# EAGLE design eTapper1main41 (EAGLE 8.4.1)
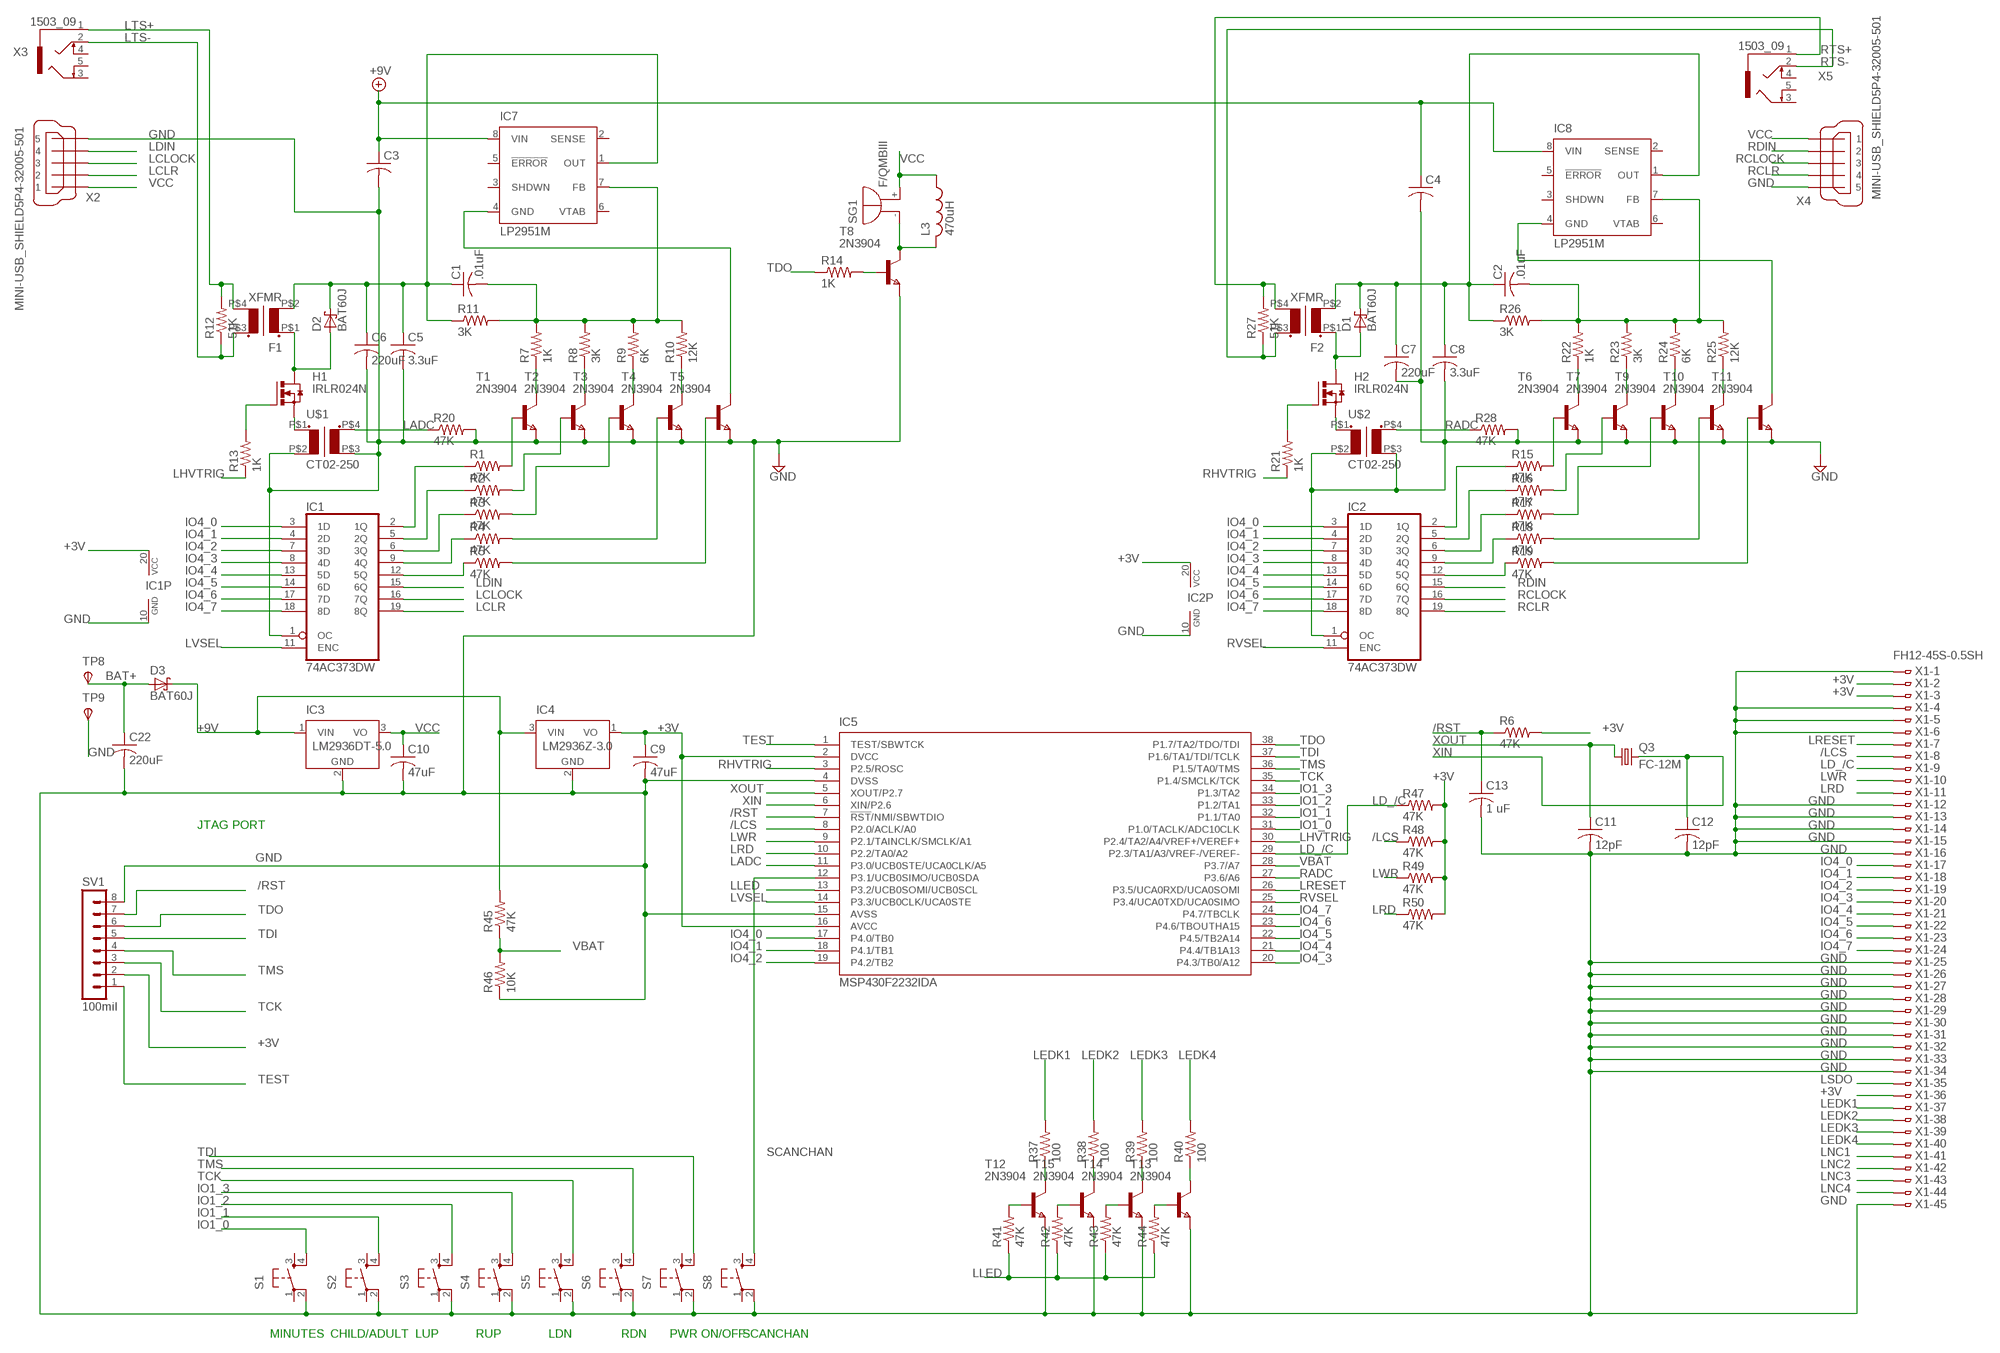
[diagram p0: schematic, sheet 1]

## Parts
C1  .01uF  C-USC0805  [C0805]
C2  .01uF  C-USC0805  [C0805]
C3  C-USC1206  [C1206]
C4  C-USC1206  [C1206]
C5  3.3uF  C-USC0805  [C0805]
C6  220uF  C-USC1206  [C1206]
C7  220uF  C-USC1206  [C1206]
C8  3.3uF  C-USC0805  [C0805]
C9  47uF  C-USC1206  [C1206]
C10  47uF  C-USC1206  [C1206]
C11  12pF  C-USC0805  [C0805]
C12  12pF  C-USC0805  [C0805]
C13  1 uF  C-USC0805  [C0805]
C22  220uF  C-USC1206  [C1206]
D1  BAT60J  [SOD323_ST]
D2  BAT60J  [SOD323_ST]
D3  BAT60J  [SOD323_ST]
F1  XFMR  [XFMR]
F2  XFMR  [XFMR]
H1  IRLR024N  [D-PAK_TO252AA]
H2  IRLR024N  [D-PAK_TO252AA]
IC1  74AC373DW  [SO20W]
IC2  74AC373DW  [SO20W]
IC3  LM2936DT-5.0  [TO252]
IC4  LM2936Z-3.0  [TO92]
IC5  MSP430F2232IDA  [TSSOP38_R-PDSO-G38-DA]
IC7  LP2951M  [SO08]
IC8  LP2951M  [SO08]
L3  470uH  L-USL2825P  [L2825P]
Q3  FC-12M  [FC-12M]
R1  47K  R-US_R0402  [R0402]
R2  47K  R-US_R0402  [R0402]
R3  47K  R-US_R0402  [R0402]
R4  47K  R-US_R0402  [R0402]
R5  47K  R-US_R0402  [R0402]
R6  47K  R-US_R0402  [R0402]
R7  1K  R-US_R0402  [R0402]
R8  3K  R-US_R0402  [R0402]
R9  6K  R-US_R0402  [R0402]
R10  12K  R-US_R0402  [R0402]
R11  3K  R-US_R0402  [R0402]
R12  51K  R-US_R0402  [R0402]
R13  1K  R-US_R0402  [R0402]
R14  1K  R-US_R0402  [R0402]
R15  47K  R-US_R0402  [R0402]
R16  47K  R-US_R0402  [R0402]
R17  47K  R-US_R0402  [R0402]
R18  47K  R-US_R0402  [R0402]
R19  47K  R-US_R0402  [R0402]
R20  47K  R-US_R0402  [R0402]
R21  1K  R-US_R0402  [R0402]
R22  1K  R-US_R0402  [R0402]
R23  3K  R-US_R0402  [R0402]
R24  6K  R-US_R0402  [R0402]
R25  12K  R-US_R0402  [R0402]
R26  3K  R-US_R0402  [R0402]
R27  51K  R-US_R0402  [R0402]
R28  47K  R-US_R0402  [R0402]
R37  100  R-US_R0402  [R0402]
R38  100  R-US_R0402  [R0402]
R39  100  R-US_R0402  [R0402]
R40  100  R-US_R0402  [R0402]
R41  47K  R-US_R0402  [R0402]
R42  47K  R-US_R0402  [R0402]
R43  47K  R-US_R0402  [R0402]
R44  47K  R-US_R0402  [R0402]
R45  47K  R-US_R0402  [R0402]
R46  10K  R-US_R0402  [R0402]
R47  47K  R-US_R0402  [R0402]
R48  47K  R-US_R0402  [R0402]
R49  47K  R-US_R0402  [R0402]
R50  47K  R-US_R0402  [R0402]
S1  10-XX  [B3F-10XX]
S2  10-XX  [B3F-10XX]
S3  10-XX  [B3F-10XX]
S4  10-XX  [B3F-10XX]
S5  10-XX  [B3F-10XX]
S6  10-XX  [B3F-10XX]
S7  10-XX  [B3F-10XX]
S8  10-XX  [B3F-10XX]
SG1  F/QMBIII  [F/QMBIII]
SV1  100mil  MA08-1  [MA08-1]
T1  2N3904  NPNSOT23  [SOT-23]
T2  2N3904  NPNSOT23  [SOT-23]
T3  2N3904  NPNSOT23  [SOT-23]
T4  2N3904  NPNSOT23  [SOT-23]
T5  2N3904  NPNSOT23  [SOT-23]
T6  2N3904  NPNSOT23  [SOT-23]
T7  2N3904  NPNSOT23  [SOT-23]
T8  2N3904  NPNSOT23  [SOT-23]
T9  2N3904  NPNSOT23  [SOT-23]
T10  2N3904  NPNSOT23  [SOT-23]
T11  2N3904  NPNSOT23  [SOT-23]
T12  2N3904  NPNSOT23  [SOT-23]
T13  2N3904  NPNSOT23  [SOT-23]
T14  2N3904  NPNSOT23  [SOT-23]
T15  2N3904  NPNSOT23  [SOT-23]
TP8  TPSPAD1-20  [P1-20]
TP9  TPSPAD1-20  [P1-20]
U$1  CT02-250  [CT02-250]
U$2  CT02-250  [CT02-250]
X1  FH12-45S-0.5SH  [FH12-45S-0.5SH]
X2  MINI-USB_SHIELD5P4-32005-501  [32005-501]
X3  1503_09  [1503_09]
X4  MINI-USB_SHIELD5P4-32005-501  [32005-501]
X5  1503_09  [1503_09]

## Nets
+3V [+3V]: C9.1 IC1.20(VCC) IC2.20(VCC) IC4.1(VO) IC5.2(DVCC) IC5.16(AVCC) R6.2 R47.2 R48.2 R49.2 R50.2 SV1.2 X1.2 X1.3 X1.36
+9V [+9V]: C3.1 C4.1 D3.C IC3.1(VIN) IC4.3(VIN) IC7.8(VIN) IC8.8(VIN) R45.2
/LCS: IC5.8(P2.0/ACLK/A0) R48.1 X1.8
/RST: C13.1 IC5.7(!RST!/NMI/SBWTDIO) R6.1 SV1.7
BAT+ [BAT+]: C22.1 D3.A TP8.TP(PP)
GND [GND]: C3.2 C4.2 C5.2 C6.2 C7.2 C8.2 C9.2 C10.2 C11.2 C12.2 C13.2 C22.2 IC1.1(OC) IC1.10(GND) IC2.1(OC) IC2.10(GND) IC3.2(GND) IC4.2(GND) IC5.4(DVSS) IC5.15(AVSS) R20.2 R28.2 R46.1 S1.2(P1) S2.2(P1) S3.2(P1) S4.2(P1) S5.2(P1) S6.2(P1) S7.2(P1) S8.2(P1) SV1.8 T1.2(E) T2.2(E) T3.2(E) T4.2(E) T5.2(E) T6.2(E) T7.2(E) T8.2(E) T9.2(E) T10.2(E) T11.2(E) T12.2(E) T13.2(E) T14.2(E) T15.2(E) TP9.TP(PP) U$1.P$2(P2) U$1.P$3(S2) U$2.P$2(P2) U$2.P$3(S2) X1.1 X1.4 X1.5 X1.6 X1.12 X1.13 X1.14 X1.15 X1.16 X1.25 X1.26 X1.27 X1.28 X1.29 X1.30 X1.31 X1.32 X1.33 X1.34 X1.45 X2.5 X4.5
IO1_0: IC5.31(P1.0/TACLK/ADC10CLK) S1.4(S1)
IO1_1: IC5.32(P1.1/TA0) S2.4(S1)
IO1_2: IC5.33(P1.2/TA1) S3.4(S1)
IO1_3: IC5.34(P1.3/TA2) S4.4(S1)
IO4_0: IC1.3(1D) IC2.3(1D) IC5.17(P4.0/TB0) X1.17
IO4_1: IC1.4(2D) IC2.4(2D) IC5.18(P4.1/TB1) X1.18
IO4_2: IC1.7(3D) IC2.7(3D) IC5.19(P4.2/TB2) X1.19
IO4_3: IC1.8(4D) IC2.8(4D) IC5.20(P4.3/TB0/A12) X1.20
IO4_4: IC1.13(5D) IC2.13(5D) IC5.21(P4.4/TB1A13) X1.21
IO4_5: IC1.14(6D) IC2.14(6D) IC5.22(P4.5/TB2A14) X1.22
IO4_6: IC1.17(7D) IC2.17(7D) IC5.23(P4.6/TBOUTHA15) X1.23
IO4_7: IC1.18(8D) IC2.18(8D) IC5.24(P4.7/TBCLK) X1.24
LADC: IC5.11(P3.0/UCB0STE/UCA0CLK/A5) R20.1 U$1.P$4(S1)
LCLOCK: IC1.16(7Q) X2.3
LCLR: IC1.19(8Q) X2.2
LD_/C: IC5.29(P2.3/TA1/A3/VREF-/VEREF-) R47.1 X1.9
LDIN: IC1.15(6Q) X2.4
LEDK1: R37.2 X1.37
LEDK2: R38.2 X1.38
LEDK3: R39.2 X1.39
LEDK4: R40.2 X1.40
LHVTRIG: IC5.30(P2.4/TA2/A4/VREF+/VEREF+) R13.1
LLED: IC5.13(P3.2/UCB0SOMI/UCB0SCL) R41.1 R42.1 R43.1 R44.1
LNC1: X1.41
LNC2: X1.42
LNC3: X1.43
LNC4: X1.44
LRD: IC5.10(P2.2/TA0/A2) R50.1 X1.11
LRESET: IC5.26(P3.5/UCA0RXD/UCA0SOMI) X1.7
LSDO: X1.35
LTS+: F1.P$4(S2) R12.2 X3.1
LTS-: F1.P$3(S1) R12.1 X3.2
LVSEL: IC1.11(ENC) IC5.14(P3.3/UCB0CLK/UCA0STE)
LWR: IC5.9(P2.1/TAINCLK/SMCLK/A1) R49.1 X1.10
N$1: IC1.2(1Q) R1.1
N$2: IC1.5(2Q) R2.1
N$3: IC1.6(3Q) R3.1
N$4: IC1.9(4Q) R4.1
N$5: IC1.12(5Q) R5.1
N$6: L3.2 SG1.-(+) T8.1(C)
N$7: R4.2 T4.3(B)
N$8: R5.2 T5.3(B)
N$9: D2.A F1.P$1(P1) H1.4(D)
N$10: R7.1 T1.1(C)
N$11: R8.1 T2.1(C)
N$12: R9.1 T3.1(C)
N$13: R1.2 T1.3(B)
N$14: R2.2 T2.3(B)
N$15: R3.2 T3.3(B)
N$16: R10.1 T4.1(C)
N$17: C1.2 IC7.7(FB) R7.2 R8.2 R9.2 R10.2 R11.2
N$18: C1.1 C5.1 C6.1 D2.C F1.P$2(P2) IC7.1(OUT) R11.1
N$19: D1.A F2.P$1(P1) H2.4(D)
N$20: IC2.2(1Q) R15.1
N$21: H1.1(G) R13.2
N$22: R14.2 T8.3(B)
N$23 [GND]: H1.3(S) U$1.P$1(P1)
N$24: IC2.5(2Q) R16.1
N$25: IC2.6(3Q) R17.1
N$26: IC2.9(4Q) R18.1
N$27: IC2.12(5Q) R19.1
N$28: R44.2 T13.3(B)
N$29: R15.2 T6.3(B)
N$30: R16.2 T7.3(B)
N$31: R17.2 T9.3(B)
N$32: R18.2 T10.3(B)
N$33: R19.2 T11.3(B)
N$35: R22.1 T6.1(C)
N$36: R23.1 T7.1(C)
N$37: R24.1 T9.1(C)
N$38: R25.1 T10.1(C)
N$39: C2.2 IC8.7(FB) R22.2 R23.2 R24.2 R25.2 R26.2
N$40: C2.1 C7.1 C8.1 D1.C F2.P$2(P2) IC8.1(OUT) R26.1
N$41: R37.1 T12.1(C)
N$42: H2.1(G) R21.2
N$43: R38.1 T15.1(C)
N$44: R39.1 T14.1(C)
N$45: IC7.4(GND) T5.1(C)
N$46: R40.1 T13.1(C)
N$47: IC8.4(GND) T11.1(C)
N$48: R43.2 T14.3(B)
N$49: R41.2 T12.3(B)
N$50: R42.2 T15.3(B)
N$51 [GND]: H2.3(S) U$2.P$1(P1)
RADC: IC5.27(P3.6/A6) R28.1 U$2.P$4(S1)
RCLOCK: IC2.16(7Q) X4.3
RCLR: IC2.19(8Q) X4.4
RDIN: IC2.15(6Q) X4.2
RHVTRIG: IC5.3(P2.5/ROSC) R21.1
RTS+: F2.P$4(S2) R27.2 X5.1
RTS-: F2.P$3(S1) R27.1 X5.2
RVSEL: IC2.11(ENC) IC5.25(P3.4/UCA0TXD/UCA0SIMO)
SCANCHAN: IC5.12(P3.1/UCB0SIMO/UCB0SDA) S8.4(S1)
TCK: IC5.35(P1.4/SMCLK/TCK) S5.4(S1) SV1.3
TDI: IC5.37(P1.6/TA1/TDI/TCLK) S7.4(S1) SV1.5
TDO: IC5.38(P1.7/TA2/TDO/TDI) R14.1 SV1.6
TEST: IC5.1(TEST/SBWTCK) SV1.1
TMS: IC5.36(P1.5/TA0/TMS) S6.4(S1) SV1.4
VBAT: IC5.28(P3.7/A7) R45.1 R46.2
VCC [VCC]: C10.1 IC3.3(VO) L3.1 SG1.+(-) X2.1 X4.1
XIN: C12.1 IC5.6(XIN/P2.6) Q3.2
XOUT: C11.1 IC5.5(XOUT/P2.7) Q3.1
Unconnected: IC7.2(SENSE) IC7.3(SHDWN) IC7.5(!ERROR) IC7.6(VTAB) IC8.2(SENSE) IC8.3(SHDWN) IC8.5(!ERROR) IC8.6(VTAB) S1.1(P) S1.3(S) S2.1(P) S2.3(S) S3.1(P) S3.3(S) S4.1(P) S4.3(S) S5.1(P) S5.3(S) S6.1(P) S6.3(S) S7.1(P) S7.3(S) S8.1(P) S8.3(S) X2.M1(S1) X2.M2(S2) X2.M3(S3) X2.M4(S4) X3.3 X3.4 X3.5 X4.M1(S1) X4.M2(S2) X4.M3(S3) X4.M4(S4) X5.3 X5.4 X5.5

## Notes on the sheet
- JTAG PORT
- MINUTES | CHILD/ADULT | LUP | RUP | LDN | RDN | PWR ON/OFF | SCANCHAN

## Library data of the parts
C1-C13 C22 = rcl:C-US: CAPACITOR, American symbol
D1-D3 = diode:BAT60J: Schottky barrier diode Source: www.st.com, BAT60J.pdf
F1 F2 = XFMR1:XFMR: Transformer 1"X1" 0.4"X0.4" hole separation for e_tapper
H1 H2 = IRLR024N:IRLR024N: IRLR024N HEXFET Power Mosfet N channel Infeneon Technology TO-251AA IPAK
IC1 IC2 = 74xx-eu:74*373: Octal D type transparent LATCH, edge triggered
IC3 = national-semiconductor:LM2936?*: Ultra-Low Quiescent Current LDO Voltage Regulator Source: Data sheet <http://www.national.com/ds/LM/LM2936.pdf>; MF: NATIONAL SEMICONDUCTOR; MPN: LM2936DT-5.0/NOPB; OC_FARNELL: 1286864; OC_NEWARK: 41K4501
IC4 = national-semiconductor:LM2936?*: Ultra-Low Quiescent Current LDO Voltage Regulator Source: Data sheet <http://www.national.com/ds/LM/LM2936.pdf>; MF: NATIONAL SEMICONDUCTOR; MPN: LM2936Z-3.0/NOPB; OC_FARNELL: 1312709; OC_NEWARK: 41K4531
IC5 = texas:MSP430F22*2IDA: MIXED SIGNAL MICROCONTROLLER Source: http://focus.ti.com/lit/ds/symlink/msp430f2274.pdf; MPN: MSP430F2232IDA; OC_FARNELL: 1610178; OC_NEWARK: 28M6312
IC7 IC8 = national-semiconductor:LP2951: Adjustable Micropower Voltage Regulator Source: http://www.national.com/ds/LP/LP2950.pdf; MF: FAIRCHILD SEMICONDUCTOR; MPN: LP2951CM; OC_FARNELL: 9488561; OC_NEWARK: 78K6014
L3 = rcl:L-US: INDUCTOR, American symbol
Q3 = crystal:FC-12M: kHz RANGE CRYSTAL UNIT LOW PROFILE SMD Source: Epson Toyocom FC-12M.pdf
R1-R28 R37-R50 = resistor:R-US_: RESISTOR, American symbol
S1-S8 = switch-omron:10-XX: OMRON SWITCH; MPN: B3F-1000; OC_FARNELL: 176432; OC_NEWARK: 36M3542
SG1 = buzzer:F/QMBIII: BUZZER Source: Buerklin; OC_FARNELL: unknown; OC_NEWARK: unknown
SV1 = con-lstb:MA08-1: PIN HEADER; OC_FARNELL: unknown; OC_NEWARK: unknown
T1-T15 = zetex:NPNSOT23: NPN TRANSISTOR; MPN: DSS20201L-7; OC_FARNELL: 1710688; OC_NEWARK: 25R4555
TP8 TP9 = testpad:TPS: TEST PIN
U$1 U$2 = CT02-250:CT02-250: Current Transformer ICE Components 1:250 turns ratio
X1 = con-hirose:FH12-45S-0.5S: 0.5mm Pitch Connectors For FPC/FFC Source: Data sheet <http://www.hirose.co.jp/cataloge_hp/e58605370.pdf>; OC_FARNELL: unknown; OC_NEWARK: unknown
X2 X4 = con-cypressindustries:MINI-USB_SHIELD5P4-: MINI USB-B R/A W/O POST 5 pol. Source: www.cypressindustries.com; OC_FARNELL: unknown; OC_NEWARK: unknown
X3 X5 = con-lumberg:1503_09: Jack connectors according to JISC 6560, 3.5 mm Klinkeneinbaukupplung nach JISC 6560, 3,5 mm, 3-polig/ stereo, abgewinkelte Ausführung, mit 2 Öffnern und Lötaugen, für Leiterplatten Rückseitenmontage Source: http://www.lumberg.com/Produkte/PDFs/1503_09.pdf; OC_FARNELL: 1243244; OC_NEWARK: unknown

## Module LP2951
Ports: 

### Library data of the parts

## Net classes
1 GND: width 0.305 mm, clearance 0.152 mm
2 BAT+: width 0.305 mm, clearance 0.152 mm
3 +9V: width 0.305 mm, clearance 0.152 mm
4 +3V: width 0.305 mm, clearance 0.152 mm
5 VCC: width 0.305 mm, clearance 0.152 mm

## Board
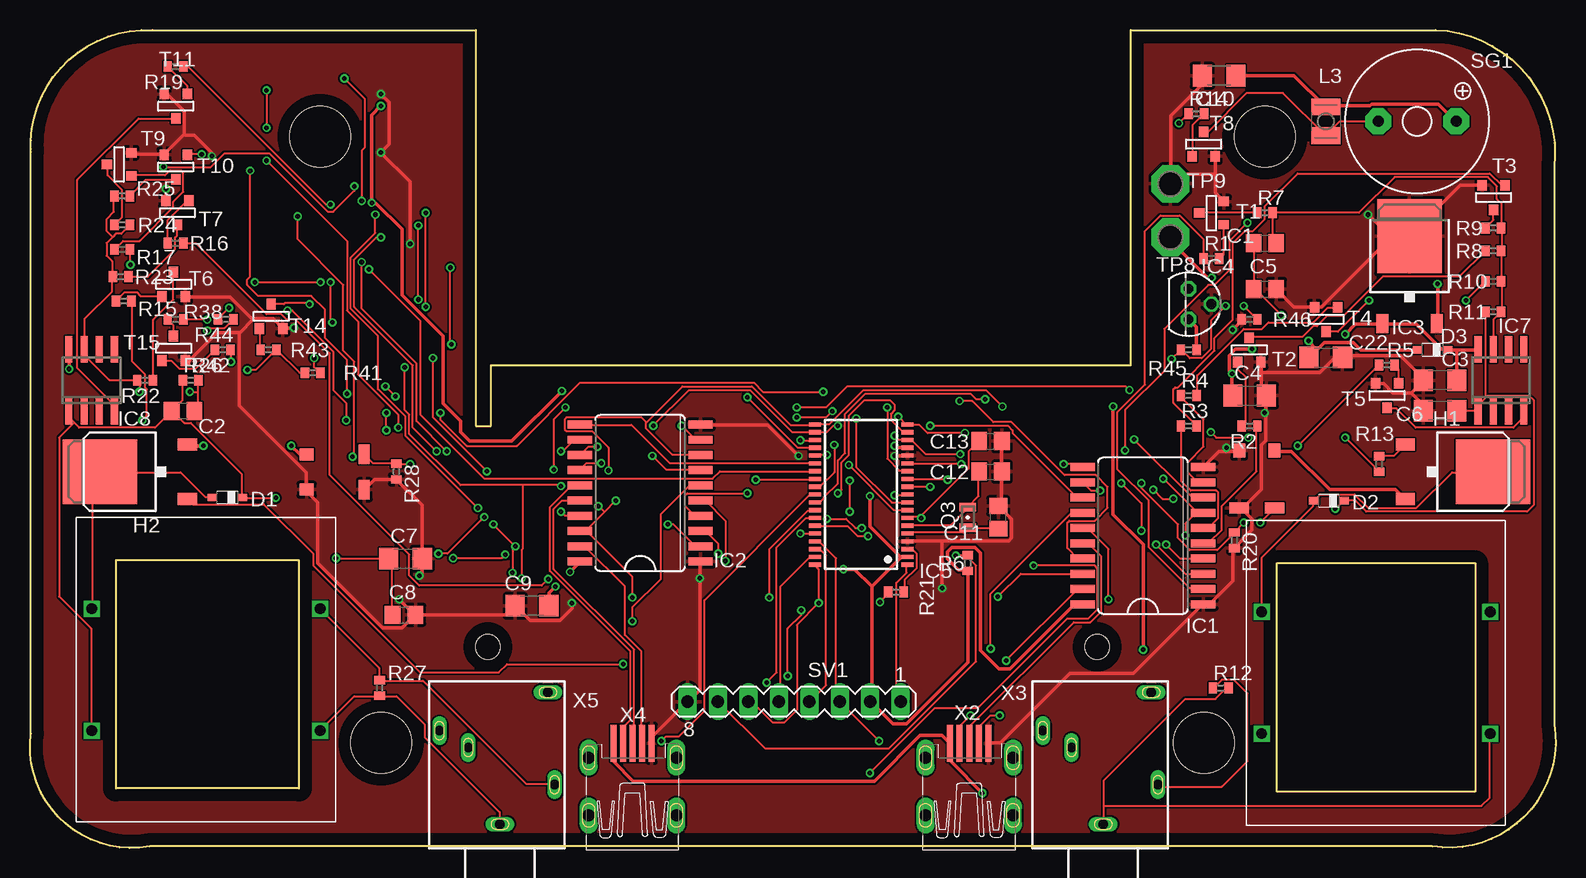
[diagram p1: board, top side]
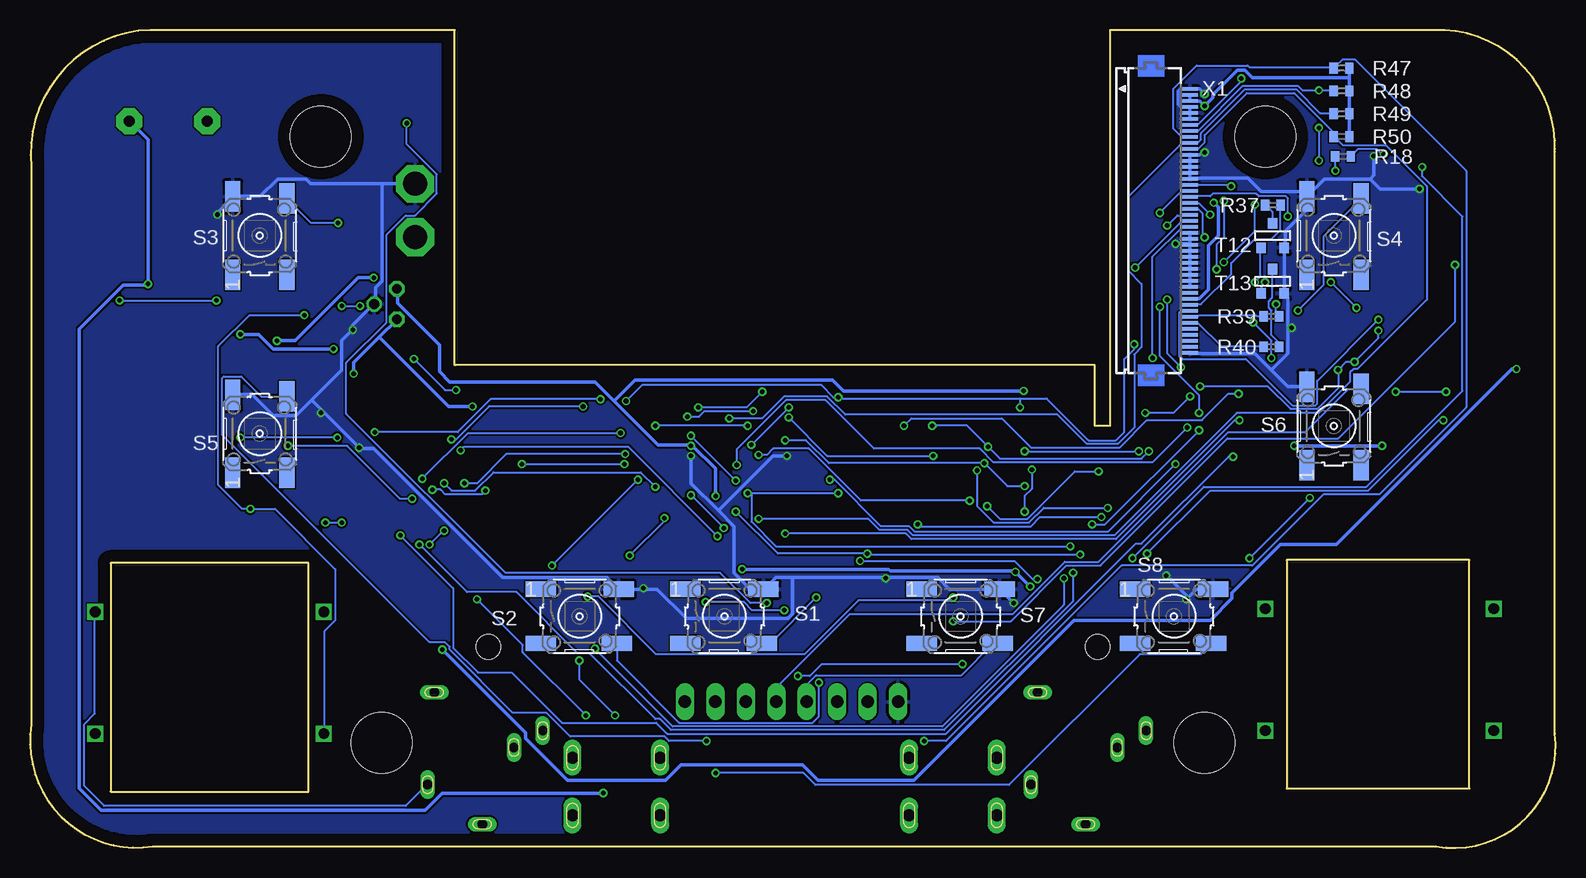
[diagram p2: board, bottom side, seen from below]

Size 127.17 x 68.21 mm. Coordinates in mm from the lower left corner, seen from the top.
Outline: 0.06,58.04 0.06,58.3 0.06,9.53
Outline: 0.06,58.04 0.06,9.53
Outline: 0.06,58.04 arc-96 10.22,68.2 37.15,68.2 37.15,35.18 38.42,35.18 38.42,40.26 91.76,40.26 91.76,68.2 117.16,68.2 arc-94 127.06,56.77 127.06,10.29 arc-108 116.9,0.13 9.97,0.13 arc-107 0.06,9.53
Outline: 103.95,23.75 120.46,23.75 120.46,4.7 103.95,4.7 103.95,23.75
Outline: 7.18,24.01 22.42,24.01 22.42,4.96 7.18,4.96 7.18,24.01
Copper layers (1*16): Top 0.035mm / dielectric 30mil / Bottom 0.035mm
Design rules "default *": minimum track width 6mil, minimum drill 15mil, track to track 6mil, track to pad 6mil, pad to pad 6mil, via to via 6mil, smd to smd 6mil, copper to edge 40mil, drill to drill 6mil, minimum pad ring 6mil, minimum via ring 6mil, stop-mask expansion 4mil, vias tented up to drill 0mil, thermal gap 10mil
Holes 5.08 mm at 24.19,59.31 102.93,59.31 29.27,8.77 97.85,8.77
Holes 2.03 mm at 38.16,16.77 88.96,16.77

### Footprints (pad centres in the part's own frame; a part is rotated, then mirrored left to right if it is on the bottom)
C0805 = smd 1.3 x 1.5: 1 -0.95,0; 2 0.95,0
C1206 = smd 1.6 x 1.8: 1 -1.4,0; 2 1.4,0
SOD323_ST = smd 0.8 x 0.6: A 1.25,0; C -1.25,0
XFMR = drill 0.889 square: P$1 -10.16,5.08; P$2 -10.16,-5.08; P$3 8.89,5.08; P$4 8.89,-5.08
D-PAK_TO252AA = smd 1 x 1.6: 1 -2.28,-4.8; 3 2.28,-4.8 | smd 5.4 x 6.2: 4 0,2.5
SO20W = smd 0.66 x 2.032: 1 -5.715,-5.029; 2 -4.445,-5.029; 3 -3.175,-5.029; 4 -1.905,-5.029; 5 -0.635,-5.029; 6 0.635,-5.029; 7 1.905,-5.029; 8 3.175,-5.029; 9 4.445,-5.029; 10 5.715,-5.029; 11 5.715,5.029; 12 4.445,5.029; 13 3.175,5.029; 14 1.905,5.029; 15 0.635,5.029; 16 -0.635,5.029; 17 -1.905,5.029; 18 -3.175,5.029; 19 -4.445,5.029; 20 -5.715,5.029
TO252 = smd 1 x 1.6: 1 -2.28,-4.8; 3 2.28,-4.8 | smd 5.4 x 6.2: 2 0,2.5
TO92 = drill 0.813 pad 1.27 octagon: 1 -1.27,0; 2 0,1.905; 3 1.27,0
TSSOP38_R-PDSO-G38-DA = smd 0.35 x 1: 1 -5.85,-3.85; 2 -5.2,-3.85; 3 -4.55,-3.85; 4 -3.9,-3.85; 5 -3.25,-3.85; 6 -2.6,-3.85; 7 -1.95,-3.85; 8 -1.3,-3.85; 9 -0.65,-3.85; 10 0,-3.85; 11 0.65,-3.85; 12 1.3,-3.85; 13 1.95,-3.85; 14 2.6,-3.85; 15 3.25,-3.85; 16 3.9,-3.85; 17 4.55,-3.85; 18 5.2,-3.85; 19 5.85,-3.85; 20 5.85,3.85; 21 5.2,3.85; 22 4.55,3.85; 23 3.9,3.85; 24 3.25,3.85; 25 2.6,3.85; 26 1.95,3.85; 27 1.3,3.85; 28 0.65,3.85; 29 0,3.85; 30 -0.65,3.85; 31 -1.3,3.85; 32 -1.95,3.85; 33 -2.6,3.85; 34 -3.25,3.85; 35 -3.9,3.85; 36 -4.55,3.85; 37 -5.2,3.85; 38 -5.85,3.85
SO08 = smd 0.6 x 2.2: 1 -1.905,-2.6; 2 -0.635,-2.6; 3 0.635,-2.6; 4 1.905,-2.6; 5 1.905,2.6; 6 0.635,2.6; 7 -0.635,2.6; 8 -1.905,2.6
L2825P = smd 1.4 x 2.4: 1 -1.2,0; 2 1.2,0
FC-12M = smd 0.7 x 1.4: 1 -0.85,0; 2 0.85,0
R0402 = smd 0.7 x 0.9: 1 -0.65,0; 2 0.65,0
B3F-10XX = smd 2.54 x 1.27: 1 -3.251,2.261; 2 3.251,2.261; 3 -3.251,-2.261; 4 3.099,-2.261
F/QMBIII = drill 0.914 pad 2.159 octagon: + 3.251,0; - -3.251,0
MA08-1 = drill 1.016 long: 1 -8.89,0; 2 -6.35,0; 3 -3.81,0; 4 -1.27,0; 5 1.27,0; 6 3.81,0; 7 6.35,0; 8 8.89,0
SOT-23 = smd 0.787 x 0.889: 1 0.025,-1.016; 2 -0.94,1.016; 3 0.991,1.016
P1-20 = drill 2.007 pad 3.15 octagon: TP 0,0
CT02-250 = smd 1 x 1.2: P$1 -1.45,-2.4; P$2 1.5,-2.4 | smd 1.6 x 0.9: P$3 1.5,2.4; P$4 -1.45,2.4
FH12-45S-0.5SH = smd 0.3 x 1.3: 1 -13,3.25; 2 -12.5,3.25; 3 -12,3.25; 4 -11.5,3.25; 5 -11,3.25; 6 -10.5,3.25; 7 -10,3.25; 8 -9.5,3.25; 9 -9,3.25; 10 -8.5,3.25; 11 -8,3.25; 12 -7.5,3.25; 13 -7,3.25; 14 -6.5,3.25; 15 -6,3.25; 16 -5.5,3.25; 17 -5,3.25; 18 -4.5,3.25; 19 -4,3.25; 20 -3.5,3.25; 21 -3,3.25; 22 -2.5,3.25; 23 -2,3.25; 24 -1.5,3.25; 25 -1,3.25; 26 -0.5,3.25; 27 0,3.25; 28 0.5,3.25; 29 1,3.25; 30 1.5,3.25; 31 2,3.25; 32 2.5,3.25; 33 3,3.25; 34 3.5,3.25; 35 4,3.25; 36 4.5,3.25; 37 5,3.25; 38 5.5,3.25; 39 6,3.25; 40 6.5,3.25; 41 7,3.25; 42 7.5,3.25; 43 8,3.25; 44 8.5,3.25; 45 9,3.25
32005-501 = smd 3.1 x 0.5: 1 3,1.6; 2 3,0.8; 3 3,0; 4 3,-0.8; 5 3,-1.6 | drill 1 pad 1.422 long: M1 -3,3.65; M2 -3,-3.65; M3 1.8,3.65; M4 1.8,-3.65
1503_09 = drill 0.8 pad 1.2 long: 1 0,-2.1; 2 -4.55,-5.4; 3 5.05,-9.9; 4 -4,-13.1; 5 2.65,-8.5

### Placement (x,y rotation side)
C1  102.93,50.42 0 top
C2  12.76,36.45 0 top
C3  117.54,38.99 180 top
C4  101.66,37.72 0 top
C5  102.93,46.61 0 top
C6  117.54,36.45 180 top
C7  31.31,24.14 0 top
C8  31.18,19.44 0 top
C9  41.85,20.2 180 top
C10  99.12,64.39 180 top
C11  80.71,27.56 90 top
C12  80.07,31.37 0 top
C13  80.07,33.91 0 top
C22  108.01,40.9 0 top
D1  16.45,29.22 180 top
D2  108.27,28.96 180 top
D3  116.9,41.53 180 top
F1  112.84,14.61 0 top
F2  15.3,14.86 0 top
H1  119.44,31.37 270 top
H2  8.32,31.37 90 top
IC1  92.77,26.04 90 top
IC2  50.86,29.6 90 top
IC3  115,48.52 0 top
IC4  96.58,45.34 270 top
IC5  69.28,29.47 90 top
IC7  122.62,38.99 0 top
IC8  5.14,38.99 0 top
L3  108.01,60.58 270 top
Q3  78.17,27.56 90 top
R1  98.49,49.15 0 top
R2  101.66,35.18 180 top
R3  96.58,35.18 0 top
R4  96.58,37.72 0 top
R5  113.09,40.26 0 top
R6  78.17,23.75 270 top
R7  102.93,52.96 0 top
R8  121.98,49.79 0 top
R9  121.98,51.69 0 top
R10  121.98,47.25 0 top
R11  121.98,44.71 0 top
R12  99.25,13.34 0 top
R13  112.46,32.01 90 top
R14  97.22,61.22 0 top
R15  7.81,45.6 180 top
R16  12.13,50.42 180 top
R17  7.68,49.92 180 top
R18  17.72,57.66 0 bottom
R19  12.13,65.16 180 top
R20  100.39,25.66 270 top
R21  72.2,21.34 180 top
R22  9.59,38.99 180 top
R23  7.56,47.63 180 top
R24  7.68,51.95 0 top
R25  7.68,54.36 180 top
R26  13.4,38.99 0 top
R27  29.15,13.34 270 top
R28  30.54,31.37 270 top
R37  23.56,53.6 0 bottom
R38  12.13,44.07 0 top
R39  23.69,44.33 180 bottom
R40  23.69,41.79 180 bottom
R41  23.56,39.63 0 top
R42  16.07,41.53 180 top
R43  19.88,41.53 180 top
R44  16.32,44.07 180 top
R45  96.58,41.53 0 top
R46  101.66,44.07 0 top
R47  17.84,65.03 0 bottom
R48  17.84,63.12 0 bottom
R49  17.84,61.22 0 bottom
R50  17.84,59.31 0 bottom
S1  69.28,19.31 0 bottom
S2  81.34,19.31 0 bottom
S3  108.01,51.06 90 bottom
S4  18.48,51.06 90 bottom
S5  108.01,34.55 90 bottom
S6  18.48,35.18 90 bottom
S7  49.59,19.31 0 bottom
S8  31.81,19.31 0 bottom
SG1  115.63,60.58 0 top
SV1  63.69,12.2 180 top
T1  98.49,52.96 270 top
T2  101.66,41.53 180 top
T3  121.98,54.23 0 top
T4  108.01,44.07 0 top
T5  113.09,37.72 0 top
T6  12,47 180 top
T7  12.26,52.96 0 top
T8  97.85,58.68 180 top
T9  7.43,57.03 270 top
T10  12.13,56.77 0 top
T11  12.13,61.85 0 top
T12  23.56,51.06 180 bottom
T13  23.56,47.25 180 bottom
T14  20.13,44.33 180 top
T15  12,41.66 180 top
TP8  95.06,50.93 0 top
TP9  95.06,55.38 0 top
U$1  102.3,30.74 180 top
U$2  25.46,31.37 270 top
X1  33.72,50.3 270 bottom
X2  78.3,5.72 90 top
X3  89.47,-0.12 180 top
X4  50.23,5.72 90 top
X5  39.18,-0.12 180 top

### Tracks (layer width: path | path; a pad name or v marks a point on that pad's centre or on a via)
+3V  (via drill 0.38)
  Top 0.305: v29.25,61.88 28.49,61.12 v28.49,53.8 28.56,53.73 28.87,53.73 31,51.59 31,46.11 34.43,42.68 34.43,37.04 35.88,35.59 35.88,34.68 36.64,33.91 40.14,33.91 v44.34,38.11 | v43.8,21.8 43.27,21.27 43.27,20.2 C9.1 | v45.02,23.02 45.86,23.86 IC2.20 | 72.61,24.24 73.06,24.24 IC5.2 | 70.17,21.8 72.61,24.24 | 70.17,21.8 70.17,12.27 SV1.2 70.09,12.2 71.92,10.37 73.06,10.37 78.17,15.47 R6.2 78.09,23.17 77.41,23.17 76.49,24.08 76.49,24.69 76.87,25.08 78.78,25.08 79.24,24.62 79.24,16.46 80.76,14.94 81.67,14.94 87.01,20.27 87.69,20.27 IC1.20 | v72.07,33.53 72.22,33.38 73.06,33.38 IC5.16 | v70.02,29.34 70.02,26.83 72.61,24.24 | v67.81,23.25 68.72,23.25 70.17,21.8
  Bottom 0.305: R50.2 17.21,59.37 17.21,61.19 R49.2 17.21,61.35 17.21,63.1 R48.2 17.21,63.25 17.21,64.24 | 17.21,64.24 17.21,65 R47.2 | v28.49,53.8 28.11,53.42 28.11,51.06 28.94,50.22 28.94,46.56 29.71,45.8 X1.36 | X1.2 30.47,62.41 X1.3 30.47,62.26 29.63,62.26 v29.25,61.88 28.56,62.57 28.56,62.79 26.5,64.85 25.9,64.85 25.29,64.24 17.21,64.24 | v43.8,21.8 v45.02,23.02 45.1,23.09 55.46,23.09 55.61,23.25 v67.81,23.25 | v70.02,29.34 70.02,31.63 71.92,33.53 v72.07,33.53 72.15,33.61 74.82,33.61 78.47,37.27 | 78.47,37.27 80.07,38.87 92.19,38.87 93.03,39.71 93.03,41.92 96.53,45.42 96.53,46.56 IC4.1 | v44.34,38.11 59.35,38.11 60.26,39.02 76.72,39.02 78.47,37.27
+9V  (via drill 0.38)
  Top 0.305: 118.94,41.53 120.69,41.53 IC7.8 | 118.94,41.53 D3.C 118.02,41.61 117.64,41.61 115.58,43.67 112.76,43.67 IC3.1 112.61,43.67 110.48,43.67 v109.64,42.83 | 118.94,41.53 118.94,39.02 C3.1 | IC4.3 97.22,43.44 97.22,41.53 R45.2 | C4.1 100.19,37.72 v100.19,39.55 99.96,39.78 99.96,41.08 100.5,41.61 v101.87,41.61 | v3.26,39.93 3.26,41.53 IC8.8 | v92.8,16.54 92.8,25.3 90.28,27.82 v90.28,36.81
  Bottom 0.305: v100.19,39.55 100.19,40.47 98.06,42.6 | IC4.3 98.06,42.6 | v3.26,39.93 3.64,39.93 18.28,25.3 22.92,25.3 26.96,21.27 26.96,20.81 28.79,18.98 40.14,18.98 53.48,5.64 61.48,5.64 62.78,6.94 72.91,6.94 74.21,5.64 82.36,5.64 85.86,9.15 85.86,9.61 v92.8,16.54 | v90.28,36.81 92.27,36.81 98.06,42.6 | v109.64,42.83 108.12,42.83 106.9,41.61 v101.87,41.61
/LCS  (via drill 0.38)
  Top 0.152: v68.26,31.93 72,28.2 73.06,28.2 IC5.8 | v30.7,35.06 30.7,36.12 27.34,39.48 27.34,43.9 26.43,44.81 26.43,50.6 v19.72,57.31 | v19.72,63.18 v19.72,60.05
  Bottom 0.152: R48.1 18.5,63.18 v19.72,63.18 21.09,63.18 21.48,63.56 26.05,63.56 29.78,59.82 30.47,59.82 X1.8 | v68.26,31.93 68.26,33.23 64.15,37.34 60.87,37.34 56.83,33.3 47.99,33.3 46.85,32.16 33.59,32.16 v30.7,35.06 | v19.72,60.05 v19.72,57.31
/RST  (via drill 0.38)
  Top 0.152: 74.24,27.63 78.24,31.63 78.24,33.08 79.08,33.91 C13.1 | 74.24,27.63 74.21,27.59 73.14,27.59 IC5.7 | 78.17,24.39 78.17,24.24 78.85,23.55 78.85,15.55 71.62,8.31 61.25,8.31 57.37,12.2 SV1.7 | v74.28,27.51 74.28,27.59 74.24,27.63 | 78.17,24.39 v77.18,24.39 | 78.17,24.39 R6.1
  Bottom 0.152: v74.28,27.51 74.28,27.29 v77.18,24.39
BAT+  (via drill 0.38)
  Top 0.305: D3.A 110.93,41.53 110.32,42.14 107.89,42.14 106.67,40.92 C22.1 107.2,41.61 106.59,42.22 v106.59,42.3 | v98.51,47.55 98.13,47.55 95.08,50.6 95.08,50.91 TP8.TP
  Bottom 0.305: v106.59,42.3 105.07,42.3 99.81,47.55 v98.51,47.55
GND  (via drill 0.38)
  Top 0.305: 99.73,33.08 99.12,33.08 IC1.10 | 99.73,33.08 100.72,33.08 U$1.P$2 | v100.27,43.21 100.95,43.9 100.95,44.05 R46.1 | v99.73,33.38 99.73,33.08 | C5.2 103.92,46.56 105.37,45.12 107.05,45.12 T4.2 107.2,45.12 107.66,45.12 113.45,50.91 114.9,50.91 IC3.2 | T3.2 119.24,55.25 115.05,51.06 IC3.2 | 98.82,56.16 98.82,54.64 99.5,53.96 T1.2 | 98.82,56.16 98.82,57.61 T8.2 | C10.2 97.68,64.39 97.68,63.63 95.08,61.04 95.08,55.4 TP9.TP 95.16,56.16 98.82,56.16 | v111.54,52.81 113.37,50.98 IC3.2 | 115.13,37.95 113.6,37.95 112.84,38.72 112.15,38.72 T5.2 | 115.13,37.95 116.12,38.94 C3.2 116.04,39.1 116.04,39.25 114.21,41.08 109.72,41.08 109.56,40.92 C22.2 109.41,40.85 108.72,40.85 107.51,39.63 102.63,39.63 | 115.13,37.95 116.12,36.96 116.12,36.51 C6.2 | 102.63,39.63 102.63,38.11 103.01,37.72 C4.2 103.01,37.65 103.01,36.28 | 102.63,39.63 102.63,40.47 T2.2 | X2.5 79.92,8.77 80.91,8.77 86.7,14.56 91.96,14.56 97.68,20.27 IC1.1 97.83,20.35 98.36,20.35 100.27,22.26 100.27,24.92 R20.2 100.42,25.08 101.87,26.52 101.87,27.44 101.03,28.28 100.8,28.28 U$1.P$3 101.1,28.35 102.63,29.88 102.63,33.61 103.01,33.99 103.01,36.28 | v102.93,36.28 103.01,36.28 | IC2.1 55.84,23.86 v55.84,22.48 55.84,13.19 54.85,12.2 SV1.8 54.7,12.12 51.88,9.3 51.88,8.77 X4.5 | C13.2 80.99,33.91 80.99,31.4 C12.2 80.99,31.25 80.99,28.89 80.76,28.66 C11.2 80.76,28.5 81.83,27.44 81.83,25.84 81.6,25.61 76.03,25.61 | 76.03,25.61 73.14,25.61 IC5.4 | v72.07,32.7 73.06,32.7 IC5.15 | v64.07,32.7 61.48,35.29 55.92,35.29 IC2.10 | v76.03,21.65 76.03,25.61 | T9.2 8.45,57.92 8.52,57.84 11.19,57.84 T10.2 11.26,57.92 12.87,59.52
  Top 0.305: T11.2 11.42,62.87 12.87,61.42 12.87,59.52 | v11.34,54.95 11.34,54.03 T7.2 | v29.25,62.87 29.93,62.18 29.93,58.68 v29.25,57.99 31.69,55.56 v31.69,50.37 | v15.15,57.69 15.15,57.99 13.7,59.44 12.94,59.44 12.87,59.52 | U$2.P$3 27.88,29.88 28.71,30.71 R28.2 30.62,30.64 32.68,28.58 32.68,24.16 C7.2 32.68,24.01 32.68,22.94 v32.45,22.71 | C8.2 39.61,19.44 40.37,20.2 C9.2 40.53,20.12 41.67,18.98 44.18,18.98 45.17,19.97 v45.17,20.43 | v30.77,20.73 31.99,19.51 C8.2 | 17.44,42.98 17.51,42.98 18.58,44.05 | 17.44,42.98 15.61,42.98 13.32,40.7 12.94,40.7 T15.2 | 18.58,44.05 18.66,44.13 20.26,44.13 T14.2 21.17,43.36 v22.01,43.36 | 18.58,44.05 16.68,45.95 12.94,45.95 T6.2 | 17.44,42.98 17.44,36.89 23,31.32 23,29.88 U$2.P$2 23.08,29.72 23.99,28.81 23.99,23.78 29.4,18.37 31,18.37 31.99,19.36 C8.2
  Bottom 0.305: S5.2 108.65,37.8 106.9,36.05 104.99,36.05 103.7,37.34 | 103.7,37.34 101.18,39.86 101.18,42.3 v100.27,43.21 100.27,43.59 98.51,45.34 IC4.2 98.36,45.42 98.36,46.72 97.83,47.25 97.83,55.4 | 103.7,37.34 102.78,36.43 | 102.78,36.43 v99.73,33.38 99.66,33.3 98.51,33.3 87.77,22.56 79.08,22.56 S2.2 76.03,21.57 | 97.83,55.4 95.08,55.4 TP9.TP | 97.83,55.4 103.77,55.4 104.15,55.78 106.51,55.78 107.96,54.34 110.25,54.34 S3.2 110.32,54.18 111.54,52.96 v111.54,52.81 | v102.93,36.28 102.78,36.43 | v72.07,32.7 72.07,30.41 69.79,28.12 | 69.79,28.12 68.49,26.83 68.49,22.94 67.12,21.57 S1.2 65.9,21.65 64.99,22.56 63.61,22.56 | v64.07,32.7 65.21,32.7 69.79,28.12 | 63.61,22.56 55.84,22.56 | 55.84,22.56 51.5,22.56 50.51,21.57 S7.2 46.24,21.49 v45.17,20.43 | 76.03,21.57 74.89,21.57 72.45,19.13 64,19.13 63.61,19.51 63.61,22.56 | v76.03,21.65 76.03,21.57 | v55.84,22.48 55.84,22.56 | 23.69,39.86 22.31,38.49 20.79,38.49 S6.2 | 23.69,39.86 25.06,41.23 30.47,41.23 X1.45 | X1.34 30.47,46.87 30.47,47.25 X1.33 30.47,47.4 30.47,47.78 X1.32 30.47,47.94 30.47,48.24 X1.31 30.47,48.39 30.47,48.77 X1.30 30.47,48.93 30.47,49.23 X1.29 30.47,49.38 30.47,49.76 X1.28 30.47,49.92 X1.27 | X1.27 30.47,50.37 30.47,50.75 X1.26 30.47,50.91 X1.25 | X1.6 30.47,60.81 30.47,61.27 X1.5 30.47,61.42 30.47,61.73 X1.4 30.62,61.8 31.23,61.8 31.46,62.03 31.46,63.1 31.23,63.33 30.54,63.33 X1.1 30.39,63.33 29.71,63.33 v29.25,62.87 | v11.34,54.95 14.62,54.95 15.46,55.78 | 15.46,55.78 19.27,55.78 S4.2 | S4.2 20.87,54.34 21.25,54.72 24.52,54.72 25.67,55.86 30.31,55.86 X1.16 30.47,55.86 30.47,56.24 X1.15 30.47,56.39 30.47,56.77 X1.14 30.47,56.93 30.47,57.23 X1.13 30.47,57.38 30.47,57.77 X1.12 30.31,57.77 29.71,57.77 29.48,57.99 v29.25,57.99
  Bottom 0.305: S4.2 20.87,54.18 20.87,53.12 22.54,51.44 22.54,50.15 T12.2 T13.2 22.54,46.11 22.31,45.88 22.31,43.36 | v31.69,50.37 30.62,50.37 X1.27 | v15.15,57.69 15.15,56.09 15.46,55.78 | 23.69,39.86 22.31,41.23 22.31,43.36 | S8.2 29.93,21.57 v30.77,20.73 30.7,20.96 v32.45,22.71 | v22.01,43.36 22.31,43.36
  pour Bottom: -1.21,69.47 128.33,69.47 128.33,-1.65 -1.21,-1.65
  pour Top: -1.21,69.47 128.33,69.47 128.33,-1.65 -1.21,-1.65
IO1_0  (via drill 0.38)
  Top 0.152: v61.63,20.88 61.63,24.92 64.83,28.12 65.37,28.12 IC5.31
  Bottom 0.152: v61.63,20.88 65.44,17.07 66.13,17.07 S1.4
IO1_1  (via drill 0.38)
  Top 0.152: v61.4,13.8 62.24,14.64 62.24,25.08 64.68,27.51 65.37,27.51 IC5.32
  Bottom 0.152: v61.4,13.8 61.4,10.98 61.94,10.44 73.06,10.44 78.24,15.63 S2.4
IO1_2  (via drill 0.38)
  Top 0.152: v69.86,25.99 69.02,25.99 68.19,26.83 65.44,26.83 IC5.33 | v91.27,33.15 91.27,36.51 94.55,39.78 94.55,43.29 98.21,46.94 98.74,46.94 99.96,48.16 99.96,50.6 v101.49,52.13
  Bottom 0.152: v69.86,25.99 77.33,33.46 90.97,33.46 v91.27,33.15 | v101.49,52.13 103.77,52.13 105.75,54.11 S3.4
IO1_3  (via drill 0.38)
  Top 0.152: v64.22,26.22 65.37,26.22 IC5.34 | v26.35,35.67 26.35,37.11 25.29,38.18 25.29,41.38 21.86,44.81 v21.48,44.81
  Bottom 0.152: v64.22,26.22 54.17,26.22 53.71,25.76 36.64,25.76 26.73,35.67 v26.35,35.67 | v21.48,44.81 19.34,46.94 19.34,50.98 16.22,54.11 S4.4
IO4_0  (via drill 0.38)
  Top 0.152: v72.07,34.37 72.38,34.07 73.06,34.07 IC5.17 73.14,33.99 73.52,33.99 74.66,32.85 v77.56,32.85 | v68.34,28.05 v68.34,30.64 | v57.37,24.54 57.37,25.38 56.38,26.37 55.92,26.37 IC2.3 | v27.04,55.17 27.04,54.79 25.29,53.04 24.83,53.04 19.95,57.92 16.22,57.92 15.07,56.77 v11.11,56.77 | v35.27,24.16 39.31,24.16 v39.61,24.47 | IC1.3 96.3,22.87 v93.87,25.3 | v92.65,26.45 92.65,28.73 v90.97,30.41
  Bottom 0.152: v68.34,30.64 v72.07,34.37 | v68.34,28.05 64.83,24.54 v57.37,24.54 57.29,24.47 v39.61,24.47 | v27.04,55.17 27.11,55.25 30.47,55.25 X1.17 | v11.11,56.77 11.11,56.01 7.76,52.66 7.76,38.11 15.76,30.1 29.32,30.1 v35.27,24.16 | v93.87,25.3 92.72,26.45 v92.65,26.45 | v90.97,30.41 89.9,30.41 87.46,32.85 v77.56,32.85
IO4_1  (via drill 0.38)
  Top 0.152: v67.35,29.57 67.65,29.88 67.65,32.16 68.26,32.77 68.26,36.05 69.56,37.34 71.69,37.34 72.07,36.96 72.07,36.51 71.77,36.2 71.77,35.67 72.76,34.68 73.06,34.68 IC5.18 | v59.8,29.57 54.78,29.57 54.62,29.42 54.62,28.5 55.38,27.74 55.84,27.74 IC2.4 | v32.98,45.12 v32.98,52.96 | v29.71,34.83 v29.71,36.28 | v38.62,26.98 v40.45,25.15 40.37,25.15 40.22,25 v40.22,22.94 | v94.7,25.3 95.85,24.16 97.75,24.16 IC1.4
  Bottom 0.152: v59.8,29.57 67.04,29.57 | v32.98,52.96 31.15,54.79 30.54,54.79 X1.18 | v32.98,45.12 32.98,41 29.71,37.72 v29.71,36.28 | v29.71,34.83 37.55,26.98 v38.62,26.98 | v40.45,25.15 64.99,25.15 67.04,27.21 67.04,29.57 | 67.04,29.57 v67.35,29.57 | v94.7,25.3 90.74,21.34 86.63,21.34 81.52,16.24 80.53,16.24 75.04,10.75 74.66,10.75 73.75,9.84 50.97,9.84 40.22,20.58 v40.22,22.94
IO4_2  (via drill 0.38)
  Top 0.152: v77.94,34.6 74.82,34.6 74.13,35.29 73.14,35.29 IC5.19 73.06,35.29 v72.38,35.97 | v94.48,30.79 97.29,27.97 97.75,27.97 IC1.7 97.22,27.97 96.3,27.06 v96.3,26.07 | v22.31,52.66 22.31,50.75 26.12,46.94 26.12,41.46 27.04,40.54 27.04,32.77 v26.89,32.62 | v51.88,32.7 53.02,31.55 55.84,31.55 IC2.7 | v63.92,35.9 66.36,35.9 v66.89,36.43
  Bottom 0.152: v77.94,34.6 90.67,34.6 v94.48,30.79 | v22.31,52.66 22.31,54.18 22.47,54.34 24.75,54.34 24.98,54.56 28.56,54.56 28.79,54.34 30.47,54.34 X1.19 | v26.89,32.62 27.27,32.62 34.51,25.38 34.96,25.38 50.81,9.53 74.05,9.53 74.97,10.44 82.82,10.44 87.01,14.64 89.83,14.64 91.88,16.69 91.88,21.65 v96.3,26.07 | v51.88,32.7 60.72,32.7 v63.92,35.9 | v66.89,36.43 70.93,36.43 71.39,35.97 v72.38,35.97
IO4_3  (via drill 0.38)
  Top 0.152: 51.38,35.48 51.35,35.44 51.35,34.98 53.56,32.77 IC2.8 | 51.38,35.48 54.39,38.49 60.19,38.49 63.39,35.29 65.37,35.29 IC5.20 65.44,35.36 66.66,35.36 69.48,38.18 79.69,38.18 v81.06,36.81 | v28.79,52.81 28.79,51.29 26.73,49.23 26.73,44.96 29.02,42.68 29.02,38.26 31.31,35.97 31.31,34.37 v37.33,28.35 | v48.22,31.48 48.22,33.38 46.85,34.75 44.72,34.75 44.56,34.91 44.56,35.74 44.72,35.9 50.97,35.9 51.38,35.48 | v92.04,34.07 96.84,29.27 97.75,29.27 IC1.8
  Bottom 0.152: v28.79,52.81 29.71,53.73 30.47,53.73 X1.20 | v37.33,28.35 42.66,28.35 43.88,27.13 46.85,27.13 48.22,28.5 v48.22,31.48 | v92.04,34.07 91.66,34.07 88.91,36.81 v81.06,36.81
IO4_4  (via drill 0.38)
  Top 0.152: v51.96,35.21 54.93,38.18 60.03,38.18 63.54,34.68 65.37,34.68 IC5.21 66.43,34.68 66.97,35.21 v67.35,35.21 | v47.31,33.46 46.55,33.46 45.86,32.77 IC2.13 | v29.25,50.91 28.87,50.91 27.04,49.08 27.04,45.12 31.92,40.24 31.92,35.06 v33.9,33.08 | v75.04,35.21 81.52,35.21 81.9,34.83 81.9,34.6 87.24,29.27 87.69,29.27 IC1.13
  Bottom 0.152: v51.96,35.21 49.06,35.21 v47.31,33.46 46.32,32.47 34.51,32.47 v33.9,33.08 | v29.25,50.91 29.4,51.06 29.4,52.89 29.78,53.27 30.47,53.27 X1.21 | v67.35,35.21 v75.04,35.21
IO4_5  (via drill 0.38)
  Top 0.152: v64.22,33.99 65.37,33.99 IC5.22 | v47.61,32.09 46.39,32.09 45.86,31.55 IC2.14 | v32.37,45.73 v32.37,51.9 | v31.23,40.09 31.23,36.51 31.61,36.12 31.61,34.52 35.88,30.26 41.06,30.26 | 41.06,30.26 44.18,30.26 v44.26,30.18 | v80.07,16.62 80.07,21.19 86.78,27.89 87.69,27.89 IC1.14 | v40.98,22.48 40.98,24.85 41.06,24.92 41.06,30.26
  Bottom 0.152: v64.22,33.99 62.47,33.99 60.57,32.09 v47.61,32.09 45.71,30.18 v44.26,30.18 | v32.37,51.9 31.53,52.74 30.54,52.74 X1.22 | v32.37,45.73 32.37,41.23 v31.23,40.09 | v80.07,16.62 73.6,10.14 51.12,10.14 40.98,20.27 v40.98,22.48
IO4_6  (via drill 0.38)
  Top 0.152: v59.8,37.57 64,33.38 65.37,33.38 IC5.23 | v77.48,37.27 78.55,37.27 80.3,35.51 81.83,35.51 86.25,31.1 88.84,31.1 89.83,30.1 89.83,28.35 88.76,27.29 86.63,27.29 86.47,27.13 86.47,25 87.31,24.16 87.69,24.16 IC1.17 | v35.04,48.39 35.04,42.07 v35.12,41.99 | v44.26,28.05 44.56,27.74 45.78,27.74 IC2.17 | v43.65,31.55 43.65,35.74 v44.64,36.73
  Bottom 0.152: v77.48,37.27 76.11,38.64 61.25,38.64 60.19,37.57 v59.8,37.57 59.73,37.5 44.64,37.5 | v35.04,48.39 31.15,52.28 30.54,52.28 X1.23 | v35.12,41.99 35.12,41.61 35.95,40.77 35.95,34.68 36.64,33.99 38.93,33.99 42.43,37.5 44.64,37.5 | v44.26,28.05 44.26,29.34 43.65,29.95 v43.65,31.55 | 44.64,37.5 v44.64,36.73
IO4_7  (via drill 0.38)
  Top 0.152: v66.43,32.77 65.44,32.77 IC5.24 | 47.88,28.01 46.32,26.45 45.86,26.45 IC2.18 46.39,26.45 50.2,22.64 v50.2,20.88 | 47.88,28.01 v48.83,28.96 | v33.59,40.85 33.59,35.9 v38.09,31.4 | 47.88,28.01 v47.38,28.5 | IC1.18 82.59,22.87 v80.68,20.96
  Bottom 0.152: v66.43,32.77 65.75,32.77 65.21,33.3 62.24,33.3 57.9,28.96 v48.83,28.96 | v33.59,40.85 33.59,49.31 31.15,51.75 30.54,51.75 X1.24 | v38.09,31.4 40.07,31.4 44.03,27.44 46.32,27.44 v47.38,28.5 | v80.68,20.96 79.77,20.96 74.97,16.16 62.62,16.16 58.13,20.66 50.43,20.66 v50.2,20.88
LADC  (via drill 0.38)
  Top 0.152: v101.18,27.13 100.42,26.37 R20.1 100.42,26.29 98.97,24.85 96.69,24.85 95.69,25.84 95.69,26.98 92.65,30.03 v92.65,30.41 | v102.55,27.13 103.7,28.28 U$1.P$4 | v75.04,30.1 73.14,30.1 IC5.11
  Bottom 0.152: v102.55,27.13 v101.18,27.13 | v75.04,30.1 76.26,31.32 88.53,31.32 90.06,29.8 92.04,29.8 v92.65,30.41
LCLOCK
  Top 0.152: IC1.16 87.77,25.38 88.23,25.38 89.29,24.31 89.29,19.74 88.38,18.83 87.01,18.83 78.32,10.14 78.32,8.77 X2.3
LCLR  (via drill 0.38)
  Top 0.152: v81.37,15.63 87.31,21.57 87.69,21.57 IC1.19 | v78.4,11.05 77.56,10.22 77.56,8.77 X2.2
  Bottom 0.152: v81.37,15.63 81.37,14.03 v78.4,11.05
LD_/C  (via drill 0.38)
  Top 0.152: v52.64,8.92 53.02,9.3 54.09,9.3 56.22,11.44 56.22,20.66 64.99,29.42 65.37,29.42 IC5.29
  Bottom 0.152: X1.9 30.54,59.37 31.23,59.37 31.84,59.97 31.84,63.33 29.93,65.23 25.67,65.23 25.51,65.08 18.5,65.08 R47.1 18.43,65.08 17.74,65.77 16.75,65.77 7.45,56.47 7.45,36.73 14.69,29.49 19.34,29.49 25.29,23.55 36.18,23.55 50.81,8.92 v52.64,8.92
LDIN  (via drill 0.38)
  Top 0.152: IC1.15 88.15,26.68 89.9,24.92 v89.9,20.73 | v80.84,11.05 80.07,11.05 79.16,10.14 79.16,8.77 X2.4
  Bottom 0.152: v89.9,20.73 86.09,16.92 86.09,16.31 v80.84,11.05
LEDK1
  Bottom 0.152: R37.2 22.92,53.57 22.92,51.52 23.69,50.75 25.06,50.75 27.04,48.77 27.04,47.86 29.55,45.34 30.47,45.34 X1.37
LEDK2  (via drill 0.38)
  Top 0.152: v14.77,44.05 12.79,44.05 R38.2
  Bottom 0.152: v14.77,44.05 19.88,38.94 19.88,37.04 20.03,36.89 21.93,36.89 25.82,40.77 31.08,40.77 31.38,41.08 31.38,44.58 31.23,44.73 30.54,44.73 X1.38
LEDK3
  Bottom 0.152: R39.2 24.37,44.35 24.9,44.35 24.98,44.43 29.71,44.43 29.78,44.35 30.47,44.35 X1.39
LEDK4
  Bottom 0.152: R40.2 24.37,41.84 27.88,41.84 29.78,43.74 30.47,43.74 X1.40
LHVTRIG  (via drill 0.38)
  Top 0.152: v109.64,34.22 112.46,31.4 R13.1 | v101.56,34.22 98.89,34.22 v98.44,34.68 | v79.62,37.42 78.85,37.42 78.4,37.88 69.63,37.88 67.96,36.2 67.96,32.92 67.35,32.31 67.35,30.41 66.21,29.27 66.21,29.19 65.9,28.89 65.44,28.89 IC5.30
  Bottom 0.152: v101.56,34.22 v109.64,34.22 | v98.44,34.68 91.5,34.68 88.76,37.42 v79.62,37.42
LLED  (via drill 0.38)
  Top 0.152: v16.75,40.54 16.75,41.53 R42.1 | v18.12,39.86 18.81,39.86 20.49,41.53 R43.1 20.56,41.53 22.47,39.63 R41.1 | v14.77,43.13 15,43.36 16.22,43.36 16.9,44.05 R44.1 | v71.46,36.73 71.46,32.47 72.45,31.48 73.06,31.48 IC5.13 | v66.13,38.03 61.1,38.03 60.34,38.79 45.86,38.79 40.6,33.53 36.41,33.53 34.2,35.74 v34.2,36.28 | v29.63,38.49 v30.47,37.65
  Bottom 0.152: v14.77,43.13 14.77,42.53 v16.75,40.54 17.44,40.54 v18.12,39.86 18.12,38.33 19.88,36.58 22.09,36.58 23.99,38.49 v29.63,38.49 | v71.46,36.73 67.42,36.73 v66.13,38.03 | v34.2,36.28 31.84,36.28 v30.47,37.65
LRD  (via drill 0.38)
  Top 0.152: v72.07,29.42 73.06,29.42 IC5.10 | v69.33,26.68 68.8,26.68 68.03,27.44 v66.43,27.44
  Bottom 0.152: X1.11 29.78,58.3 29.25,58.83 29.25,59.44 25.74,62.95 21.78,62.95 18.5,59.67 18.5,59.37 R50.1 18.43,59.29 17.74,58.6 14.16,58.6 10.73,55.17 10.73,45.73 16.52,39.93 16.83,39.93 17.13,39.63 17.13,38.87 19.72,36.28 26.58,36.28 36.79,26.07 53.56,26.07 54.01,26.52 56.38,26.52 57.29,27.44 v66.43,27.44 | v69.33,26.68 v72.07,29.42
LRESET  (via drill 0.38)
  Top 0.152: v28.26,48.24 32.52,43.97 32.52,36.12 37.86,30.79 56.91,30.79 57.52,31.4 65.37,31.4 IC5.26 | v27.65,53.96 27.65,58.15 27.88,58.37 27.88,62.49 v26.2,64.17
  Bottom 0.152: v28.26,48.24 28.26,50.3 27.65,50.91 v27.65,53.96 | v26.2,64.17 26.2,63.94 29.78,60.36 30.47,60.36 X1.7
LTS+
  Top 0.152: R12.2 99.73,13.34 98.82,12.43 96.3,12.43 89.52,5.64 89.52,3.51 | 89.52,3.51 89.52,1.99 X3.1 | 89.52,3.51 120.99,3.51 121.68,4.2 121.68,9.53 F1.P$4
LTS-
  Top 0.152: R12.1 98.67,13.34 99.35,14.03 100.34,14.03 101.49,12.88 101.49,7.24 99.35,5.11 94.25,5.11 94.09,5.26 X3.2
  Bottom 0.152: F1.P$3 121.75,19.67 121.75,11.21 122.67,10.29 122.67,5.19 120.99,3.51 95.85,3.51 94.09,5.26 X3.2
LVSEL  (via drill 0.38)
  Top 0.152: v77.64,32.01 73.14,32.01 IC5.14 | v86.17,32.01 87.46,32.01 87.69,31.78 IC1.11
  Bottom 0.152: v86.17,32.01 v77.64,32.01
LWR  (via drill 0.38)
  Top 0.152: v68.87,35.82 68.87,31.78 71.84,28.81 73.06,28.81 IC5.9
  Bottom 0.152: R49.1 18.5,61.27 19.65,61.27 21.63,63.25 25.9,63.25 29.55,59.59 29.55,59.06 29.78,58.83 30.47,58.83 X1.10 30.54,58.76 31.15,58.76 35.65,54.26 35.65,48.16 34.51,47.02 34.51,41.76 35.12,41.15 35.12,35.06 36.49,33.69 39.08,33.69 41.52,36.12 59.19,36.12 60.72,37.65 64.3,37.65 66.13,35.82 v68.87,35.82
N$1
  Top 0.152: R1.1 97.83,50.75 95.85,52.74 94.25,52.74 92.95,51.44 92.95,38.64 90.67,36.35 90.67,31.55 93.26,28.96 93.26,25.08 96.69,21.65 97.75,21.65 IC1.2
N$2
  Top 0.152: R2.1 102.25,35.13 102.25,31.4 99.35,28.5 99.35,26.52 98.29,25.46 97.83,25.46 IC1.5
N$3
  Top 0.152: IC1.6 98.21,26.68 99.05,27.51 99.05,29.65 98.89,29.8 96.76,29.8 96,30.56 96,35.13 R3.1
N$4
  Top 0.152: IC1.9 97.37,30.49 96.53,31.32 96.53,32.16 97.83,33.46 97.83,35.74 96,37.57 96,37.72 R4.1
N$5  (via drill 0.38)
  Top 0.152: v105.68,33.53 112.38,40.24 R5.1 | v95.31,29.11 94.4,29.11 v93.64,29.88 | v89.22,29.8 88.46,29.8 87.77,30.49 IC1.12
  Bottom 0.152: v105.68,33.53 100.72,33.53 96.3,29.11 v95.31,29.11 | v93.64,29.88 92.95,29.88 92.57,29.49 89.52,29.49 v89.22,29.8
N$6
  Top 0.152: T8.1 97.83,59.75 98.21,59.75 101.41,62.95 104.46,62.95 107.96,59.44 L3.2 108.04,59.44 109.18,60.58 SG1.-
N$7
  Top 0.152: T4.3 108.95,45.04 108.19,45.04 106.97,43.82 103.24,43.82 102.7,43.29 101.18,43.29 97.29,39.4 97.29,37.72 R4.2
N$8
  Top 0.152: T5.3 114.06,38.79 114.06,39.93 113.75,40.24 R5.2
N$9
  Top 0.152: F1.P$1 102.7,19.74 102.7,24.24 106.97,28.5 106.97,28.96 D2.A 107.05,28.96 107.58,29.49 110.4,29.49 111.54,28.35 115.58,28.35 118.55,31.32 121.91,31.32 H1.4
N$10
  Top 0.152: R7.1 97.52,52.96 T1.1
N$11
  Top 0.152: T2.1 101.64,42.6 106.06,42.6 106.97,43.52 107.28,43.52 108.12,44.35 109.49,44.35 112.76,47.63 119.16,47.63 121.3,49.76 R8.1
N$12
  Top 0.152: T3.1 121.98,53.19 121.98,52.35 121.37,51.75 R9.1
N$13
  Top 0.152: T1.3 99.5,49.46 99.2,49.15 R1.2
N$14
  Top 0.152: T2.3 100.72,40.47 100.72,39.86 101.33,39.25 101.33,35.51 101.03,35.21 R2.2
N$15
  Top 0.152: T3.3 122.67,55.25 121.68,56.24 105.68,56.24 102.93,53.5 102.93,52.43 101.94,51.44 101.26,51.44 100.27,50.45 100.27,44.05 98.74,42.53 98.74,41.46 95.69,38.41 95.47,38.41 95.31,38.26 95.31,37.11 97.22,35.21 R3.2
N$16  (via drill 0.38)
  Top 0.152: T4.1 109.03,43.06 v111.62,45.65 | v119.7,45.65 121.3,47.25 R10.1
  Bottom 0.152: v119.7,45.65 v111.62,45.65
N$17
  Top 0.152: 103.62,52.96 103.62,50.68 103.85,50.45 C1.2 | 122.67,47.25 122.67,44.73 R11.2 122.59,44.66 121.98,44.05 IC7.7 | 122.67,47.25 122.67,49.76 R8.2 122.67,49.84 122.67,51.67 R9.2 122.67,51.75 122.67,53.73 122.29,54.11 122.29,55.17 121.53,55.94 113.75,55.94 110.78,52.96 103.62,52.96 | 122.67,47.25 R10.2 | 103.62,52.96 R7.2
N$18  (via drill 0.38)
  Top 0.152: C1.1 102.02,50.37 102.02,46.64 C5.1 102.1,46.64 v104.31,44.43 | 121.41,37.61 120.76,36.96 120.76,36.43 IC7.1 120.69,36.43 119.01,36.43 C6.1 | 121.41,37.61 121.53,37.72 124.96,37.72 125.34,37.34 125.34,28.58 124.8,28.05 111.39,28.05 110.48,28.96 D2.C 109.49,28.96 v108.8,28.28 | R11.1 121.37,44.66 121.37,37.65 121.41,37.61
  Bottom 0.152: F1.P$2 102.63,9.53 102.63,18.06 101.71,18.98 101.71,23.25 106.74,28.28 v108.8,28.28 109.49,28.28 111.47,30.26 111.47,41.84 108.88,44.43 v104.31,44.43
N$19
  Top 0.152: D1.A 15.15,29.27 14.62,29.27 12.56,31.32 5.85,31.32 H2.4 5.85,31.25 5.17,30.56 5.17,19.97 F2.P$1
N$20  (via drill 0.38)
  Top 0.152: v9.36,35.67 9.74,36.05 9.74,38.26 9.59,38.41 9.59,39.48 8.52,40.54 8.52,45.57 R15.1 | v34.05,24.54 34.81,24.54 v37.86,27.59 | v53.17,26.98 53.63,26.98 55.46,25.15 IC2.2
  Bottom 0.152: v9.36,35.67 9.74,35.67 15.61,29.8 28.79,29.8 v34.05,24.54 | v37.86,27.59 42.96,27.59 43.73,26.83 53.02,26.83 v53.17,26.98
N$21
  Top 0.152: R13.2 112.46,32.7 113.68,32.7 114.59,33.61 H1.1
N$22
  Top 0.152: T8.3 96.91,57.69 96.91,60.28 97.83,61.19 R14.2
N$23
  Top 0.305: U$1.P$1 103.77,33.08 105.14,33.08 108.34,29.88 113.83,29.88 114.59,29.11 H1.3
N$24  (via drill 0.38)
  Top 0.152: v43.19,22.41 42.66,21.87 32.45,21.87 31.61,22.71 31.61,24.47 24.98,31.1 24.98,41.23 22.16,44.05 21.4,44.05 20.94,44.51 19.72,44.51 13.86,50.37 12.79,50.37 R16.1 | v57.98,23.93 57.98,27.29 56.3,28.96 IC2.5
  Bottom 0.152: v43.19,22.41 43.57,22.41 45.1,23.93 v57.98,23.93
N$25  (via drill 0.38)
  Top 0.152: v8.37,48.62 8.37,49.92 R17.1 | v50.2,18.9 50.2,20.05 52.57,22.41 52.57,27.82 54.93,30.18 55.84,30.18 IC2.6
  Bottom 0.152: v8.37,48.62 8.37,43.9 18.12,34.14 27.34,34.14 37.93,23.55 40.75,23.55 45.4,18.9 v50.2,18.9
N$26  (via drill 0.38)
  Top 0.152: v18.35,56.47 18.35,47.63 18.12,47.4 18.12,46.94 19.04,46.03 23.46,46.03 24.6,44.89 24.6,42.53 26.43,40.7 v26.43,37.88 | v54.32,35.21 55.46,34.07 55.84,34.07 IC2.9
  Bottom 0.152: v18.35,56.47 18.35,57.61 R18.1 | v26.43,37.88 27.27,37.88 29.48,35.67 34.05,35.67 36.33,33.38 43.73,33.38 46.16,35.82 53.71,35.82 v54.32,35.21
N$27  (via drill 0.38)
  Top 0.152: R19.1 13.17,65.16 24.68,53.65 v25.06,53.65 | v27.65,48.85 27.65,44.96 32.22,40.39 32.22,35.59 v34.73,33.08 | v44.26,33.08 44.41,33.08 45.33,33.99 45.78,33.99 IC2.12
  Bottom 0.152: v25.06,53.65 25.06,51.44 v27.65,48.85 | v44.26,33.08 v34.73,33.08
N$28  (via drill 0.38)
  Top 0.152: v18.73,47.17 v24.22,47.17 | v16.6,45.04 15.68,44.13 R44.2
  Bottom 0.152: v24.22,47.17 24.52,46.87 24.52,46.26 T13.3 | v16.6,45.04 v18.73,47.17
N$29
  Top 0.152: T6.3 10.96,46.03 9.21,46.03 8.9,46.34 7.91,46.34 7.23,45.65 R15.2
N$30
  Top 0.152: T7.3 13.25,53.96 13.09,53.96 11.49,52.35 11.49,50.45 R16.2
N$31
  Top 0.152: T9.3 8.45,56.09 11.26,56.09 11.65,56.47 12.64,56.47 12.79,56.32 12.79,54.72 11.95,53.88 11.95,53.42 9.13,50.6 7.76,50.6 7.07,49.92 R17.2
N$32  (via drill 0.38)
  Top 0.152: v14.31,57.84 13.17,57.84 T10.3
  Bottom 0.152: v14.31,57.84 14.47,57.84 14.92,58.3 16.45,58.3 17.06,57.69 R18.2
N$33
  Top 0.152: T11.3 13.09,62.87 13.09,63.56 11.49,65.16 R19.2
N$35
  Top 0.152: T6.1 11.95,48.01 11.95,45.73 10.27,44.05 10.27,39.02 R22.1
N$36
  Top 0.152: R23.1 9.82,47.63 12.1,49.92 12.1,50.91 12.26,51.06 12.26,51.9 T7.1
N$37
  Top 0.152: T9.1 6.46,57 6.46,56.09 7.68,54.87 7.68,52.58 7.07,51.97 R24.1
N$38
  Top 0.152: T10.1 12.1,55.71 9.66,55.71 8.37,54.41 R25.1
N$39  (via drill 0.38)
  Top 0.152: 6.85,47.63 6.85,48.93 6.39,49.38 6.39,50.45 6.88,50.95 | 6.88,50.95 7.15,51.21 7.61,51.21 8.29,51.9 R24.2 | 6.88,50.95 6.39,51.44 6.39,52.43 7,53.04 7,54.34 R25.2 | 14.01,38.03 14.01,36.73 13.78,36.51 C2.2 | 14.01,38.03 14.01,38.94 R26.2 | v13.32,38.03 14.01,38.03 | v9.13,38.03 9.13,38.79 8.98,38.94 R22.2 8.9,39.02 6.62,39.02 4.56,41.08 4.56,41.53 IC8.7 4.56,41.61 4.56,44.13 6.85,46.41 6.85,47.63 | 6.85,47.63 R23.2
  Bottom 0.152: v9.13,38.03 v13.32,38.03
N$40  (via drill 0.38)
  Top 0.152: C8.1 30.16,19.44 30.16,23.86 29.93,24.08 C7.1 29.86,24.16 v25.51,24.16 | C2.1 11.87,36.43 12.87,35.44 13.4,35.44 17.67,31.17 17.67,29.27 D1.C 17.74,29.19 v20.49,29.19 | R26.1 12.71,38.94 12.71,37.34 11.87,36.51 C2.1 | 3.68,35.48 4.1,35.06 10.43,35.06 11.8,36.43 C2.1 | 3.68,35.48 3.26,35.9 3.26,36.35 IC8.1 | 3.68,35.48 2.43,34.22 2.43,20.96 5.09,18.29 5.09,9.84 F2.P$2
  Bottom 0.152: v20.49,29.19 v25.51,24.16
N$41
  Bottom 0.152: T12.1 23.61,52.13 23.61,53.04 24.14,53.57 R37.1
N$42  (via drill 0.38)
  Top 0.152: v70.85,20.5 71.54,21.19 71.54,21.34 R21.2 | v64.3,19.82 64.3,19.44 63.16,18.29 v63.16,14.33 | v49.44,15.32 39.76,15.32 39.08,14.64 32.52,14.64 23.61,23.55 23.61,24.54 19.49,28.66 13.55,28.66 13.17,29.04 H2.1
  Bottom 0.152: v70.85,20.5 67.65,20.5 66.97,19.82 v64.3,19.82 | v63.16,14.33 62.17,14.33 61.18,15.32 v49.44,15.32
N$43
  Top 0.152: T15.1 11.95,42.68 11.95,43.59 11.49,44.05 R38.1
N$44  (via drill 0.38)
  Top 0.152: T14.1 21.17,45.34 21.25,45.42 23.23,45.42 v23.3,45.34
  Bottom 0.152: v23.3,45.34 23.3,44.58 23.08,44.35 R39.1
N$45
  Top 0.152: T5.1 113.14,36.66 113.91,36.66 115.51,35.06 123.66,35.06 124.5,35.9 124.5,36.35 IC7.4
N$46
  Bottom 0.152: T13.1 23.61,48.24 23.61,45.88 23.91,45.57 23.91,45.04 23.69,44.81 23.69,42.75 23.08,42.14 23.08,41.84 R40.1
N$47
  Top 0.152: T11.1 12.1,60.81 9.06,60.81 3.95,55.71 3.95,40.01 7,36.96 7,36.43 IC8.4
N$48
  Top 0.152: T14.3 19.19,43.29 19.19,41.53 R43.2
N$49  (via drill 0.38)
  Top 0.152: v25.06,47.17 25.06,43.97 v25.21,43.82 | v23.69,40.85 23.69,40.09 24.14,39.63 R41.2
  Bottom 0.152: v25.06,47.17 24.6,47.63 24.6,49.99 T12.3 | v25.21,43.82 23.69,42.3 v23.69,40.85
N$50
  Top 0.152: T15.3 11.04,40.62 11.8,40.62 12.48,39.93 13.78,39.93 15.38,41.53 R42.2
N$51  (via drill 0.38)
  Top 0.305: v21.78,33.53 22.47,32.85 23,32.85 U$2.P$1 | v14.47,33.53 13.25,33.53 13.17,33.61 H2.3
  Bottom 0.305: v14.47,33.53 v21.78,33.53
RADC  (via drill 0.38)
  Top 0.152: U$2.P$4 27.88,32.77 28.56,32.09 30.54,32.09 R28.1 30.54,32.01 v31.69,32.01 | v60.49,30.71 65.37,30.71 IC5.27
  Bottom 0.152: v60.49,30.71 60.11,30.71 56.22,26.83 53.86,26.83 53.4,26.37 37.33,26.37 v31.69,32.01
RCLOCK
  Top 0.152: IC2.16 44.34,28.96 43.65,28.28 43.65,23.25 50.36,16.54 50.36,8.84 50.28,8.77 X4.3
RCLR
  Top 0.152: IC2.19 46.24,25.15 49.59,21.8 49.59,17.76 50.97,16.39 50.97,8.77 X4.4
RDIN
  Top 0.152: IC2.15 45.78,30.18 45.1,30.18 43.35,28.43 43.35,23.09 50.05,16.39 50.05,10.67 49.44,10.06 49.44,8.77 X4.2
RHVTRIG
  Top 0.152: R21.1 72.91,21.34 72.91,22.33 73.9,23.32 73.9,24.54 73.6,24.85 73.14,24.85 IC5.3
RTS+
  Top 0.152: F2.P$4 24.22,9.84 27.04,12.65 29.1,12.65 R27.2 29.17,12.65 30.54,12.65 32.91,10.29 32.91,9.23 39.15,2.98 39.15,1.99 X5.1
RTS-
  Top 0.152: F2.P$3 24.22,19.89 29.1,15.02 29.1,14.03 R27.1 29.17,13.95 32.75,13.95 41.36,5.34 43.73,5.34 X5.2
RVSEL
  Top 0.152: IC5.25 65.37,32.09 53.33,32.09 50.13,35.29 45.86,35.29 IC2.11
SCANCHAN  (via drill 0.38)
  Top 0.152: v76.49,30.71 73.14,30.71 IC5.12 | v83.65,23.55 88.76,23.55 88.99,23.32 88.99,19.89 88.23,19.13 86.47,19.13 79.01,11.66 75.43,11.66 v70.02,6.25
  Bottom 0.152: v83.65,23.55 v76.49,30.71 | v70.02,6.25 62.7,6.25 61.71,5.26 45.55,5.26 34.66,16.16 29.55,16.16 28.71,17 S8.4
TCK  (via drill 0.38)
  Top 0.152: IC5.35 65.44,25.53 65.82,25.53 67.2,24.16 67.2,12.5 SV1.3 v70.78,8.92
  Bottom 0.152: S5.4 107.89,37.65 109.56,39.32 111.01,39.32 111.16,39.17 111.16,34.45 93.87,17.15 92.57,17.15 92.19,16.77 92.19,16.54 86.93,11.28 84.11,11.28 82.13,9.3 74.28,9.3 73.9,8.92 v70.78,8.92
TDI
  Top 0.152: IC5.37 65.37,24.24 64.99,24.24 62.55,21.8 62.55,12.27 62.47,12.2 SV1.5
  Bottom 0.152: S7.4 46.55,17 46.93,17 49.52,14.41 61.63,14.41 62.4,13.65 62.4,12.2 SV1.5
TDO  (via drill 0.38)
  Top 0.152: v95.77,60.43 96.53,61.19 R14.1 | IC5.38 65.44,23.55 65.75,23.25 v65.75,20.43 63.92,18.6 63.92,11.51 62.85,10.44 61.94,10.44 60.19,12.2 SV1.6
  Bottom 0.152: v95.77,60.43 95.77,58.68 93.26,56.16 93.26,54.56 95.08,52.74 95.85,52.74 97.45,51.14 97.45,43.82 100.8,40.47 100.8,36.2 87.54,22.94 69.63,22.94 67.12,20.43 v65.75,20.43
TEST
  Top 0.152: IC5.1 73.06,23.55 73.06,22.94 72.22,22.1 72.22,12.5 72.53,12.2 SV1.1
TMS
  Top 0.152: IC5.36 65.44,24.85 65.9,24.85 66.36,24.39 66.36,13.57 64.99,12.2 SV1.4
  Bottom 0.152: S6.4 16.22,38.26 17.28,38.26 20.87,34.68 27.27,34.68 38.09,23.86 40.91,23.86 45.25,19.51 58.81,19.51 64.91,13.42 64.91,12.2 SV1.4
VBAT  (via drill 0.38)
  Top 0.152: v99.66,45.19 98.44,43.97 98.44,41.61 97.68,40.85 96.69,40.85 96,41.53 R45.1 v95.16,40.77 | v101.18,45.19 102.25,44.13 R46.2 | v67.04,33.61 67.04,31.32 65.9,30.18 65.44,30.18 IC5.28 | v63.92,36.73 66.36,36.73 68.11,38.49 91.35,38.49 v91.66,38.18
  Bottom 0.152: v101.18,45.19 v99.66,45.19 | v63.92,36.73 v67.04,33.61 | v91.66,38.18 92.57,38.18 v95.16,40.77
VCC  (via drill 0.38)
  Top 0.305: X4.1 48.68,8.69 48.68,7.17 50.28,5.57 70.4,5.57 74.21,9.38 76.03,9.38 76.64,8.77 X2.1 76.8,8.62 76.8,7.17 v79.39,4.58 | C10.1 105.37,64.39 107.96,61.8 L3.1 108.12,61.88 111.7,61.88 111.85,62.03 117.41,62.03 118.86,60.58 SG1.+ | v117.34,47.02 117.34,43.74 IC3.3
  Bottom 0.305: SG1.+ 118.86,60.58 117.34,59.06 v117.34,47.02 117.41,46.94 119.39,46.94 123.05,43.29 123.05,4.96 121.22,3.13 94.25,3.13 92.8,4.58 v79.39,4.58
XIN
  Top 0.152: IC5.6 73.14,26.9 76.72,26.9 78.17,28.35 Q3.2 78.17,28.43 79.08,29.34 79.08,31.32 C12.1
XOUT
  Top 0.152: 78.17,26.68 77.79,26.29 73.14,26.29 IC5.5 | 78.17,26.68 80.68,26.68 C11.1 | 78.17,26.68 Q3.1